# EasyEDA schematic esquema cubo.json
TITLE: Sheet_1; REV: 1.0; Date: 2024-01-10; Sheet: 1/1; Company: Your Company
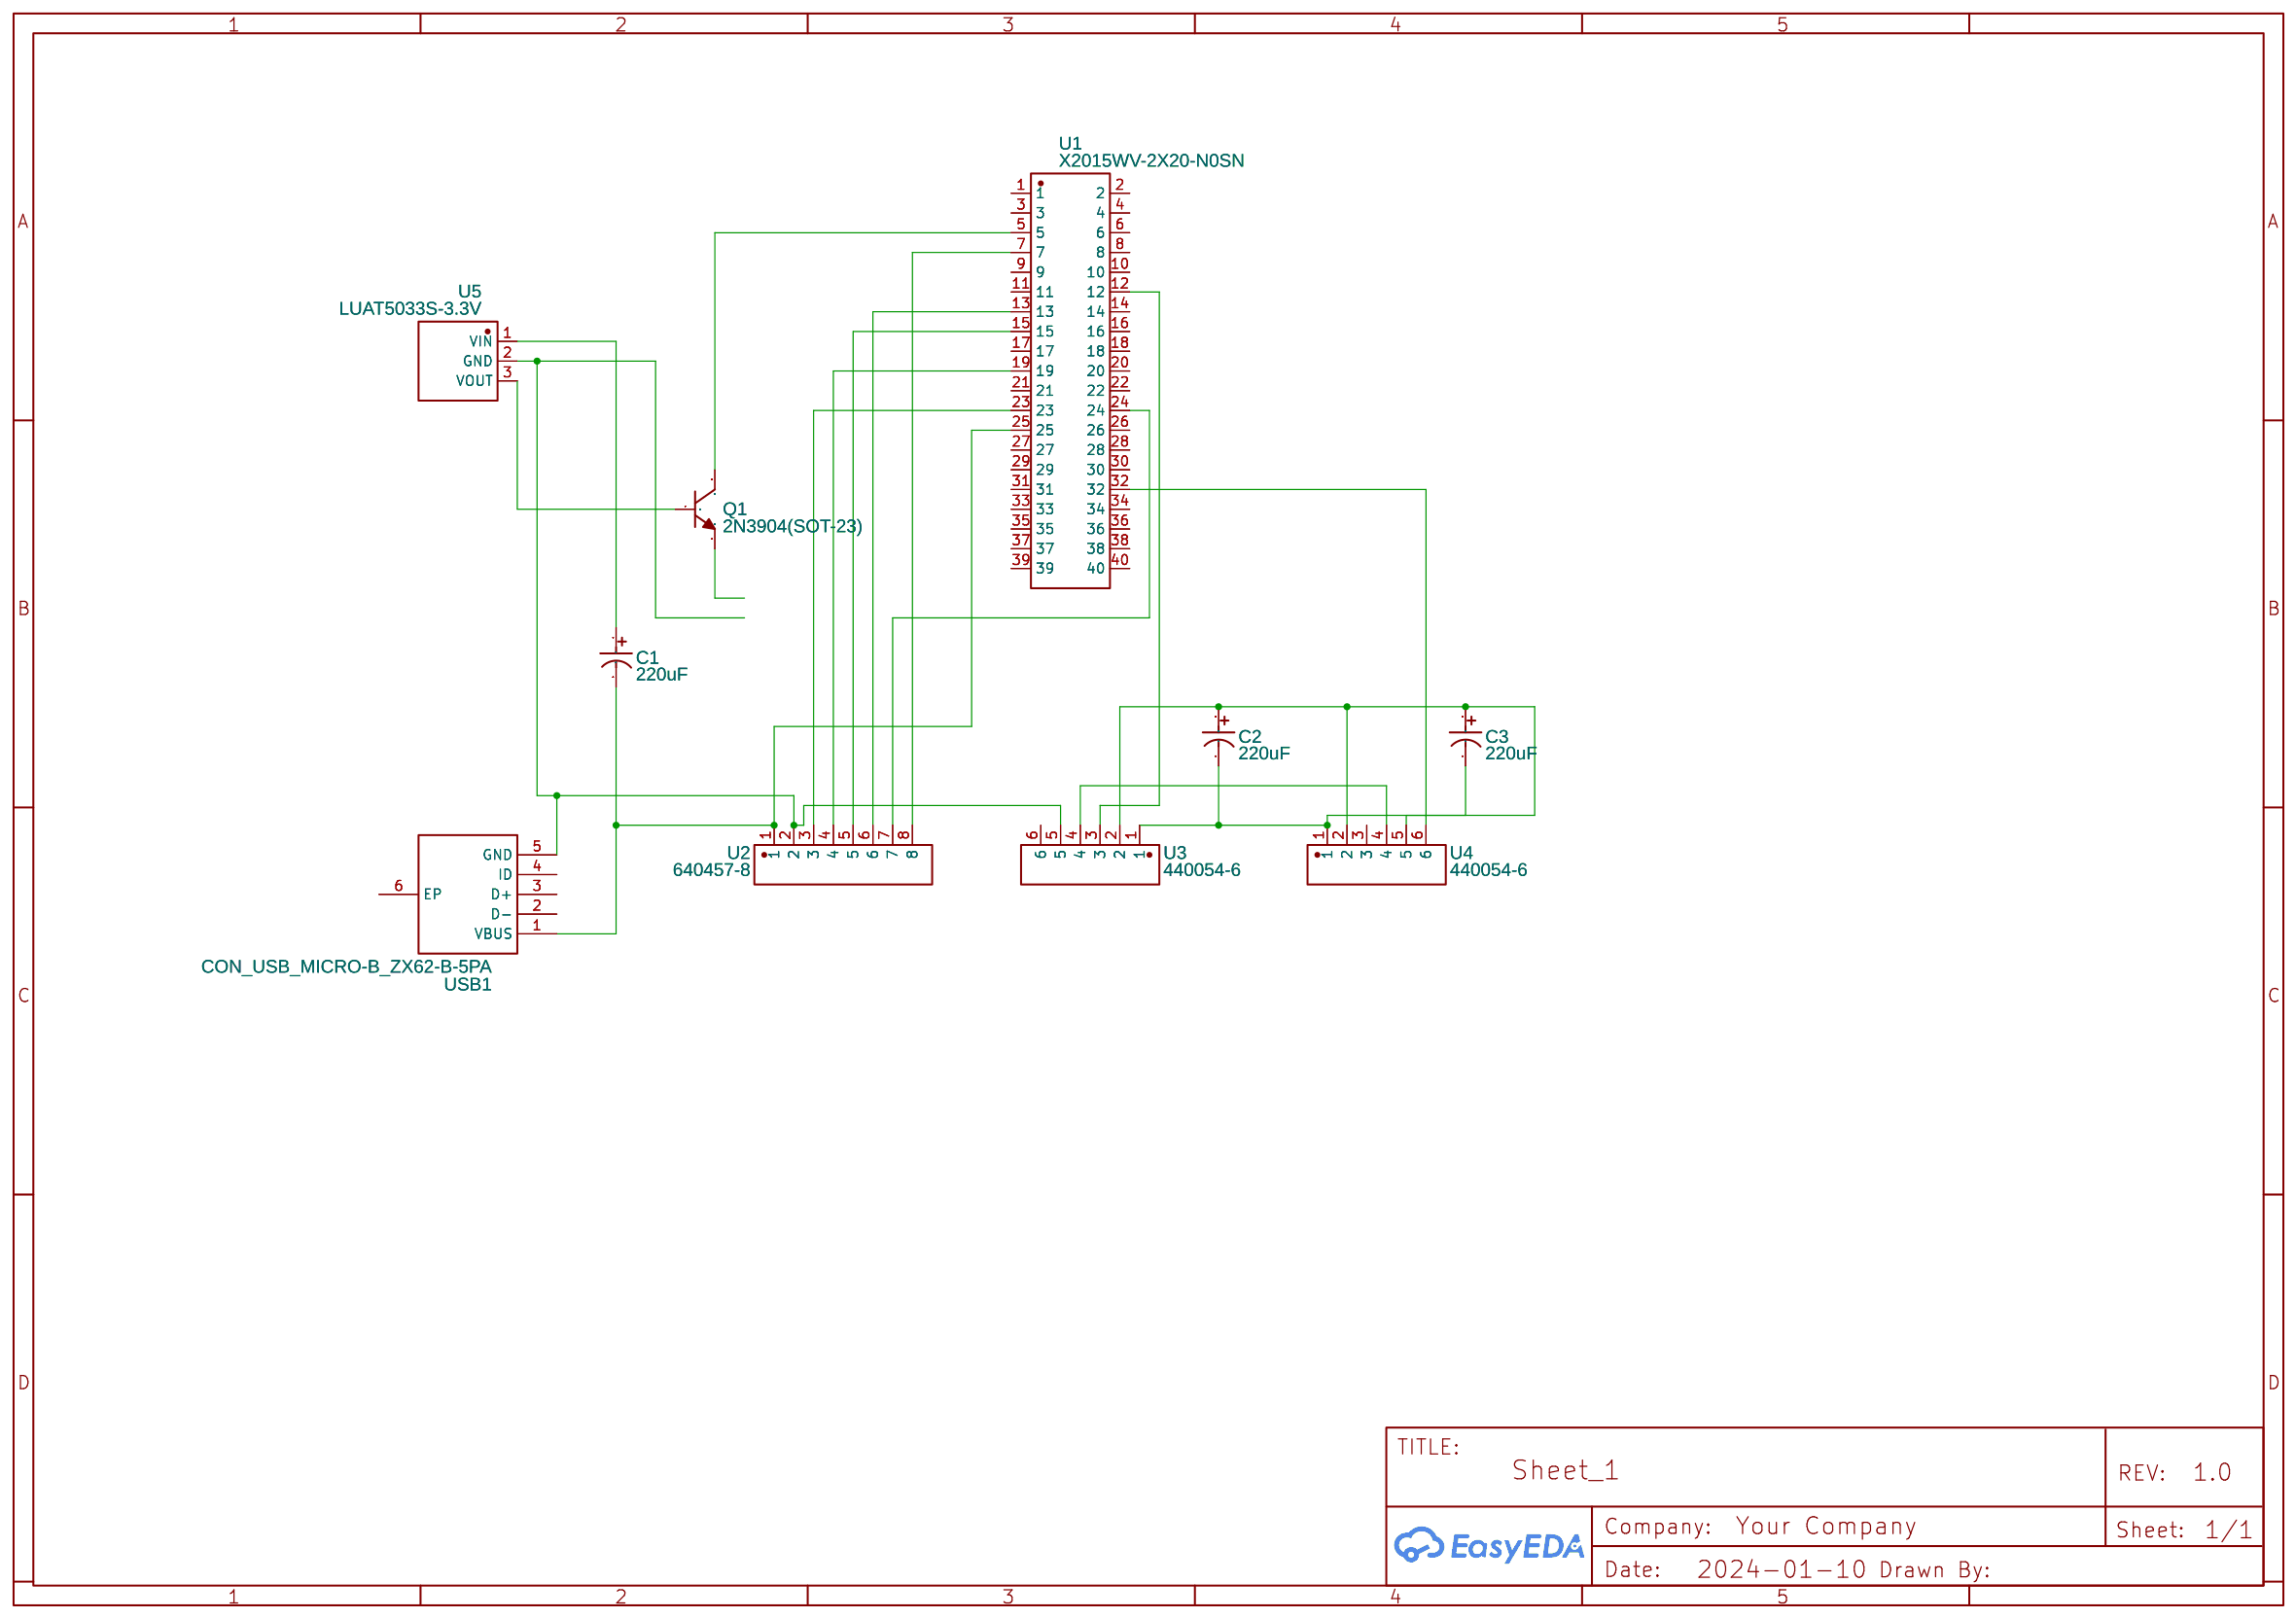
[diagram p0: schematic sheet]

## Parts
C1  220uF  [CAP-TH_BD6.3-P2.50-D1.0-FD]
C2  220uF  [CAP-TH_BD6.3-P2.50-D1.0-FD]
C3  220uF  [CAP-TH_BD6.3-P2.50-D1.0-FD]
Q1  2N3904(SOT-23)  [SOT-23-3_L2.9-W1.3-P1.90-LS2.4-TR]
U1  X2015WV-2X20-N0SN  [CONN-TH_X2015WV-2X20-N0SN]
U2  640457-8  [CONN-TH_8P-P2.54_640457-8]
U3  440054-6  [CONN-TH_TE_440054-6]
U4  440054-6  [CONN-TH_TE_440054-6]
U5  LUAT5033S-3.3V  [PWRM-SMD_LUAT5033S-3.3V]
USB1  CON_USB_MICRO-B_ZX62-B-5PA  [MICRO-USB-SMD_MICRO-USB-BTC-MC5S-42]

## Library data of the parts
C1-C3 = MHA-16V220-6.3*11: Contributor: LCSC; Supplier: LCSC; Supplier Part: C165514; Manufacturer: SAMYOUNG(韩国三莹); Manufacturer Part: MHA 16V220 6.3*11; JLCPCB Part Class: Extended Part
Q1 = 2N3904(SOT-23): Supplier: LCSC; Manufacturer: KEC; Manufacturer Part: 2n3904S-RTK/PS; Supplier Part: C18536; Paste Type: SOT-23; Contributor: LCEDA_Lib
U1 = X2015WV-2X20-N0SN: Contributor: LCSC; Supplier: LCSC; Supplier Part: C2882181; Manufacturer: XKB Connectivity(中国星坤); Manufacturer Part: X2015WV-2x20-46SN; JLCPCB Part Class: Extended Part
U2 = 640457-8: Contributor: lcsc; Supplier: LCSC; Supplier Part: C5168753; Manufacturer: TE Connectivity(美国泰科)
U3 U4 = 440054-6: Contributor: lcsc; Supplier: LCSC; Supplier Part: C3040951; Manufacturer: TE Connectivity(美国泰科)
U5 = LUAT5033S-3.3V: Contributor: lcsc; Supplier: LCSC; Supplier Part: C3038763; Manufacturer: null; Manufacturer Part: Luat5033S-3.3V; JLCPCB Part Class: Extended Part
USB1 = CON_USB_MICRO-B_ZX62-B-5PA: Contributor: LCSC; Supplier: LCSC; Supplier Part: C9900003149; Manufacturer: null; JLCPCB Part Class: Extended Part

## Nets
Net-(C1-1): C1.1 U5.1(VIN)
Net-(C1-2): C1.2 U1.25 U2.1 USB1.1(VBUS)
Net-(C2-1): C2.1 C3.1 U3.2 U4.2 U4.5
Net-(C2-2): C2.2 C3.2 U3.1 U4.1
Net-(Q1-2): Q1.2(B) U5.3(VOUT)
Net-(Q1-3): Q1.3(C) U1.5
Net-(U1-7): U1.7 U2.8
Net-(U1-12): U1.12 U3.3
Net-(U1-13): U1.13 U2.6
Net-(U1-15): U1.15 U2.5
Net-(U1-19): U1.19 U2.4
Net-(U1-23): U1.23 U2.3
Net-(U1-24): U1.24 U2.7
Net-(U1-32): U1.32 U4.6
Net-(U2-2): U2.2 U3.5 U5.2(GND) USB1.5(GND)
Net-(U3-4): U3.4 U4.4

Not connected (* = marked no-connect by the designer): Q1 1(E); U1 1 2 3 4 6 8 9 10 11 14 16 17 18 20 21 22 26 27 28 29 30 31 33 34 35 36 37 38 39 40; U3 6; U4 3; USB1 2(D-) 3(D+) 4(ID) 6(EP)
